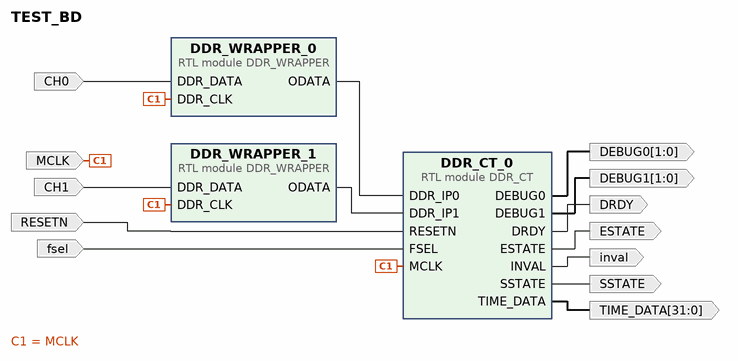
[diagram p0: block diagram of the top level]
# Vivado block design TEST_BD, xc7z020clg400-1, Vivado 2019.1
create_bd_design TEST_BD

create_bd_port -dir I -type clk MCLK
set_property -dict {CONFIG.FREQ_HZ 500000000} [get_bd_ports MCLK]
create_bd_port -dir I -type rst RESETN
create_bd_port -dir I -type data CH0
create_bd_port -dir I -type data CH1
create_bd_port -dir O -from 31 -to 0 -type data TIME_DATA
create_bd_port -dir O -type data SSTATE
create_bd_port -dir O -type data ESTATE
create_bd_port -dir O -type data DRDY
create_bd_port -dir O inval
create_bd_port -dir I fsel
create_bd_port -dir O -from 1 -to 0 -type data DEBUG0
create_bd_port -dir O -from 1 -to 0 -type data DEBUG1

create_bd_cell -type module -reference DDR_WRAPPER DDR_WRAPPER_0
create_bd_cell -type module -reference DDR_WRAPPER DDR_WRAPPER_1
create_bd_cell -type module -reference DDR_CT DDR_CT_0

# ---- connections ----

connect_bd_net [get_bd_ports MCLK] [get_bd_pins DDR_WRAPPER_1/DDR_CLK] [get_bd_pins DDR_WRAPPER_0/DDR_CLK] [get_bd_pins DDR_CT_0/MCLK]
connect_bd_net -net CH0_1 [get_bd_ports CH0] [get_bd_pins DDR_WRAPPER_0/DDR_DATA]
connect_bd_net -net CH1_1 [get_bd_ports CH1] [get_bd_pins DDR_WRAPPER_1/DDR_DATA]
connect_bd_net [get_bd_ports RESETN] [get_bd_pins DDR_CT_0/RESETN]
connect_bd_net [get_bd_ports fsel] [get_bd_pins DDR_CT_0/FSEL]
connect_bd_net [get_bd_pins DDR_WRAPPER_0/ODATA] [get_bd_pins DDR_CT_0/DDR_IP0]
connect_bd_net [get_bd_pins DDR_WRAPPER_1/ODATA] [get_bd_pins DDR_CT_0/DDR_IP1]
connect_bd_net [get_bd_pins DDR_CT_0/SSTATE] [get_bd_ports SSTATE]
connect_bd_net [get_bd_pins DDR_CT_0/ESTATE] [get_bd_ports ESTATE]
connect_bd_net [get_bd_pins DDR_CT_0/DRDY] [get_bd_ports DRDY]
connect_bd_net [get_bd_pins DDR_CT_0/TIME_DATA] [get_bd_ports TIME_DATA]
connect_bd_net [get_bd_pins DDR_CT_0/INVAL] [get_bd_ports inval]
connect_bd_net [get_bd_pins DDR_CT_0/DEBUG0] [get_bd_ports DEBUG0]
connect_bd_net [get_bd_pins DDR_CT_0/DEBUG1] [get_bd_ports DEBUG1]

validate_bd_design
save_bd_design
